# Altium schematic sheet PWR_5to3.3_AMS1117.SchDoc
size A4
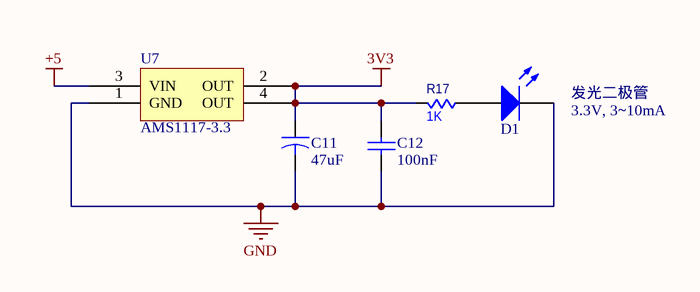
[diagram p0: PWR_5to3.3_AMS1117.SchDoc]

## Parts
C11  value 47uF  [Cap-47uF]  (hidden comment: Cap Pol)
C12  value 100nF  [0603]  (hidden comment: Cap)
D1  LED  [LED_0805]  (value not drawn)
R17  value 1K  [0603]  (hidden comment: Res)
U7  AMS1117-3.3  [SOT223]

## Nets
3V3: C11.1 C12.2 R17.2 U7.2(OUT) U7.4(OUT)
+5: U7.3(VIN)
GND: C11.2 C12.1 D1.2(K) U7.1(GND)
NetD1_1: D1.1(A) R17.1

## Notes on the sheet
- (near D1) 发光二极管
- (near D1) 3.3V, 3~10mA

## Library data of the parts
C11 = Cap Pol: Capacitor; Published: 23-Sep-2002; PackageReference: CAPR5-4X5; Publisher: Altium Limited
C12 = Cap: 无极性电容; Published: 8-Jun-2000; LatestRevisionDate: 17-Jul-2002; LatestRevisionNote: Re-released for DXP Platform.; PackageReference: RAD-0.3; Publisher: Altium Limited
D1 = LED: 发光二极管; Published: 8-Jun-2000; LatestRevisionDate: 08-Jul-2005; LatestRevisionNote: Mech Layer 1 removed.; PackageReference: LED-0; Publisher: Altium Limited
R17 = Res: 常规电阻
U7 = AMS1117-3.3: DCDC